# EAGLE design v01 (EAGLE 8.5.2)
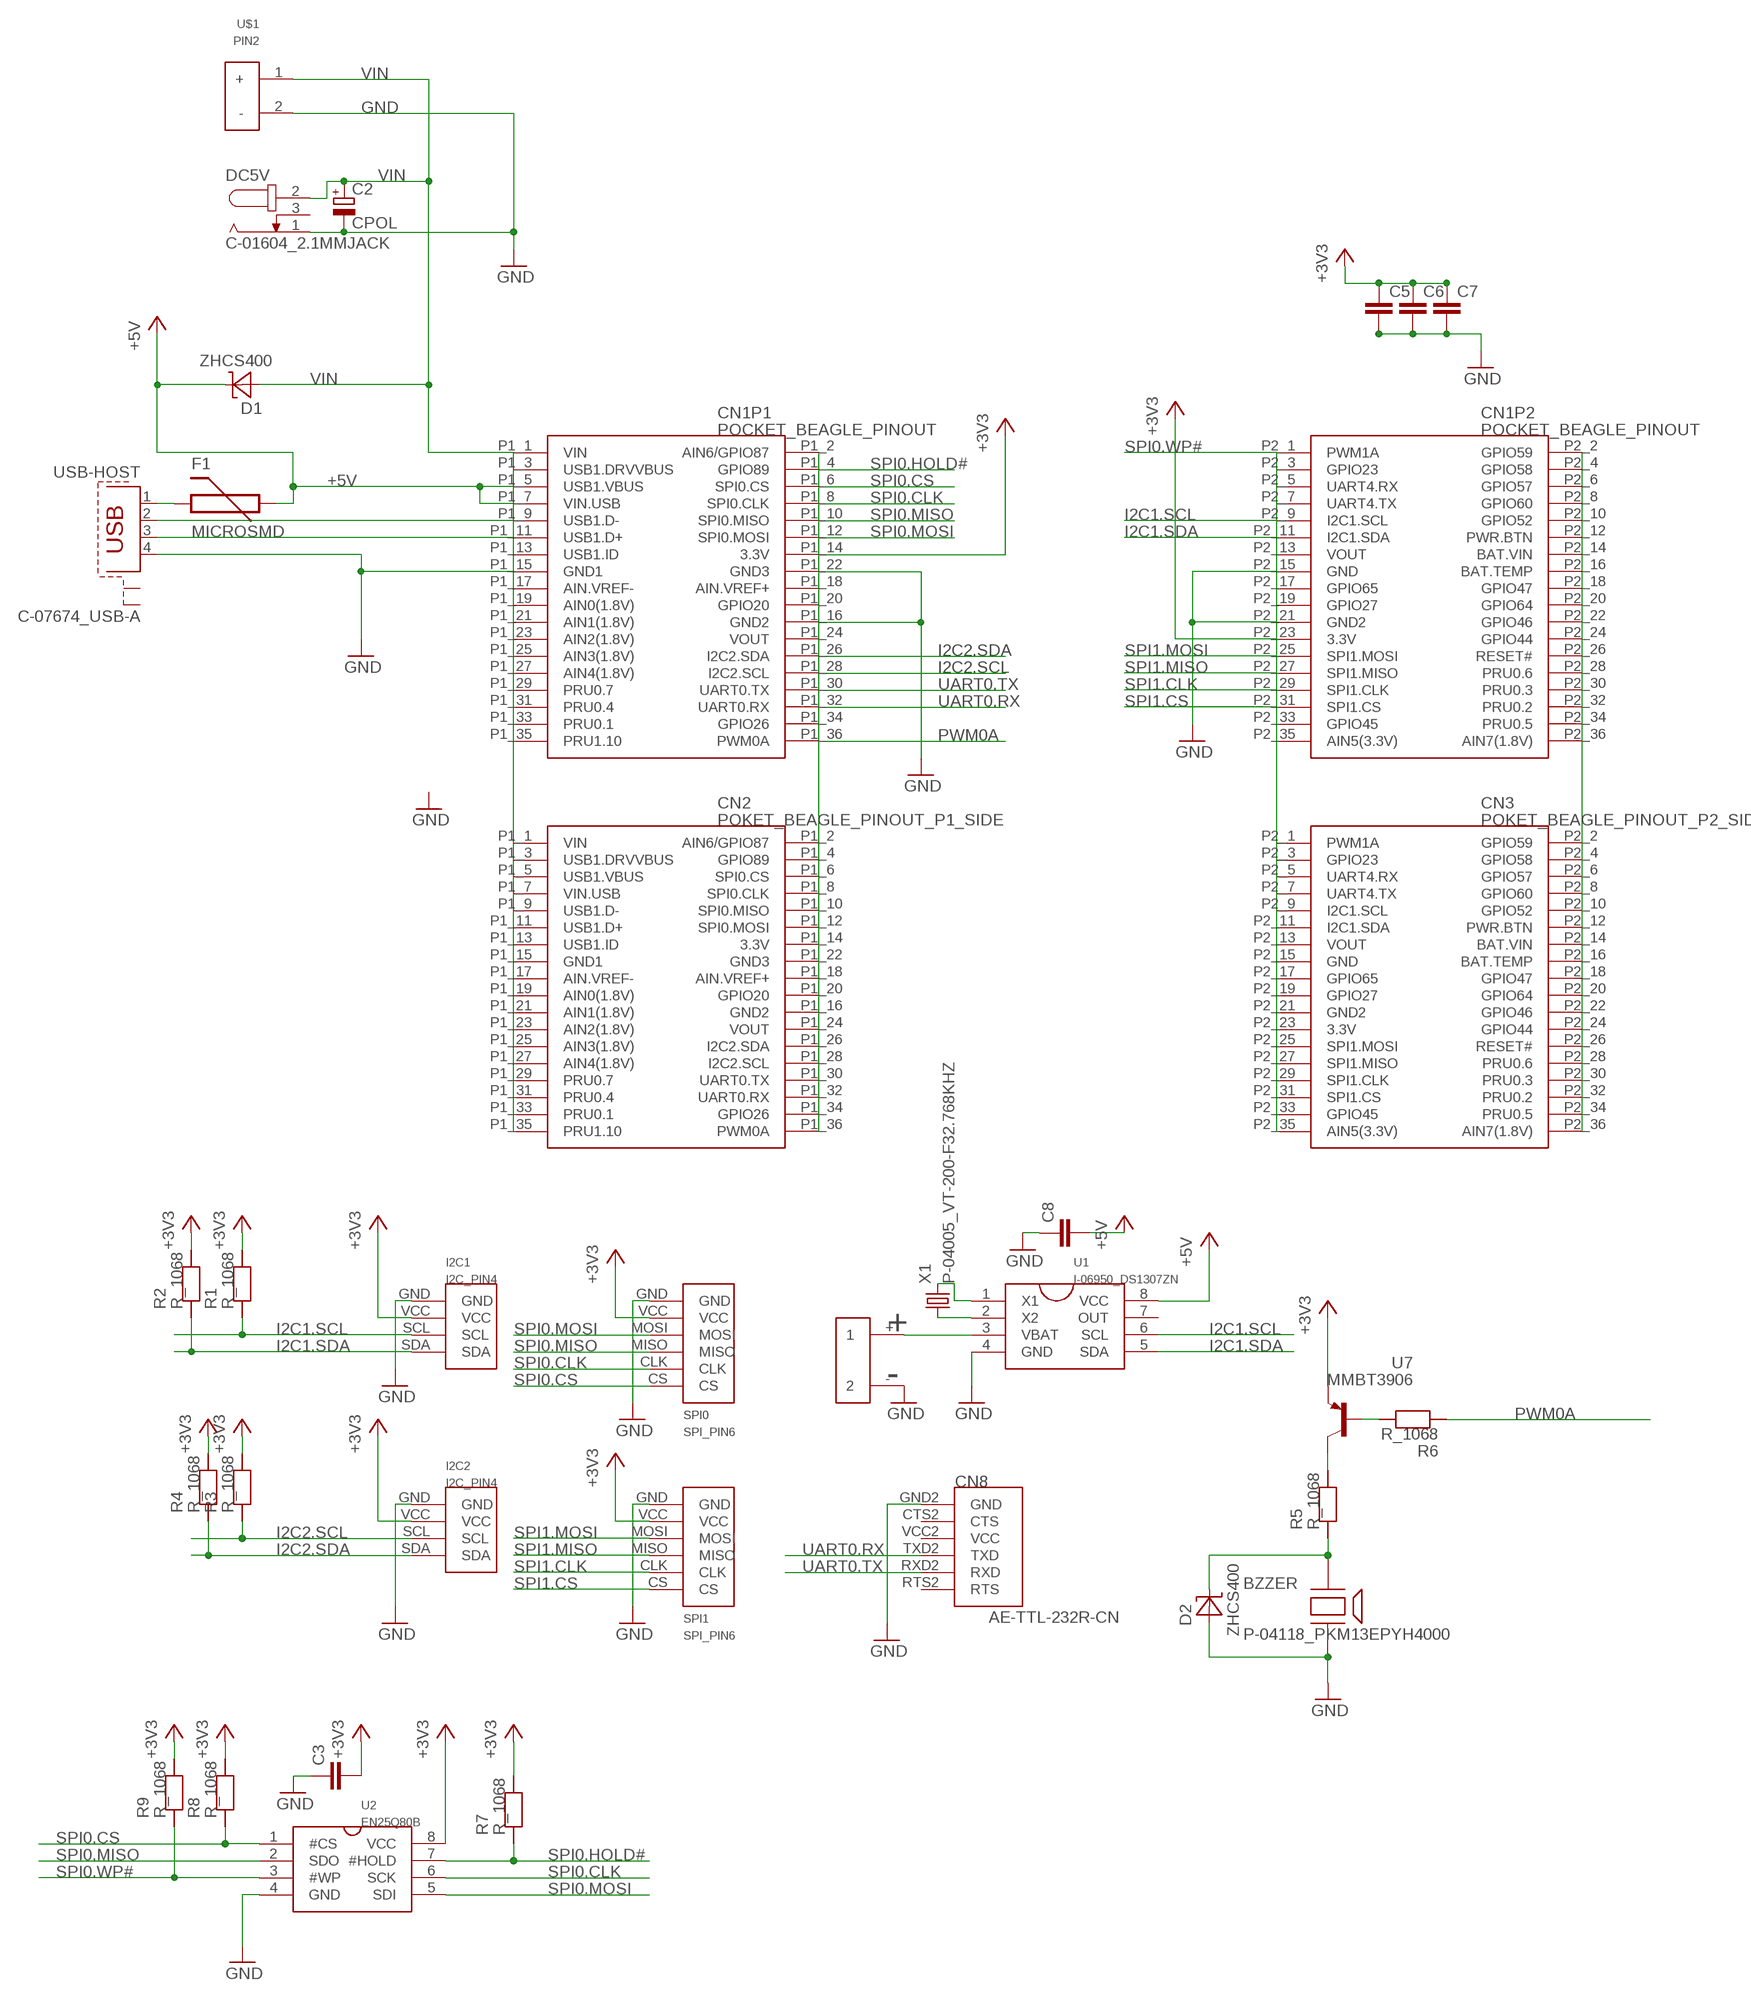
[diagram p0: schematic, sheet 1]

## Parts
BZZER  P-04118_PKM13EPYH4000  [PKM13EPYH4000]
C2  CPOL  [153CLV-0605]
C3  C_1068  [C0603]
C5  C_2012  [C0805K]
C6  C_1068  [C0603]
C7  C_1068  [C0603]
C8  C_1068  [C0603]
CN1  POCKET_BEAGLE_PINOUT  [POCKET_BEAGLE_PINOUT]
CN2  POKET_BEAGLE_PINOUT_P1_SIDE  [POKET_BEAGLE_PINOUT_P1_SIDE]
CN3  POKET_BEAGLE_PINOUT_P2_SIDE  [POKET_BEAGLE_PINOUT_P2_SIDE]
CN8  AE-TTL-232R-CN  [AE-TTL-232R-CN]
CR2032  P-00706_CH25-2032LF  [CH25-2032LF]
D1  ZHCS400  [SOD323-W]
D2  ZHCS400  [SOD323-W]
DC5V  C-01604_2.1MMJACK  [2.1MMJACK]
F1  MICROSMD  [MICROSMD]
I2C1  I2C_PIN4  [I2C_PIN4]
I2C2  I2C_PIN4  [I2C_PIN4]
R1  R_1068  [R0603]
R2  R_1068  [R0603]
R3  R_1068  [R0603]
R4  R_1068  [R0603]
R5  R_1068  [R0603]
R6  R_1068  [R0603]
R7  R_1068  [R0603]
R8  R_1068  [R0603]
R9  R_1068  [R0603]
SPI0  SPI_PIN6  [SPI_PIN6]
SPI1  SPI_PIN6  [SPI_PIN6]
U1  I-06950_DS1307ZN  [SO8]
U2  EN25Q80B  [SO8]
U7  MMBT3906  [SOT23]
U$1  PIN2  [PIN2]
USB-HOST  C-07674_USB-A  [PN87520-S]
X1  P-04005_VT-200-F32.768KHZ  [VT-200F]

## Nets
+3V3: C3.2 C5.1 C6.1 C7.1 CN1.P1_14(P1:3.3V) CN1.P2_23(P2:3.3V) CN2.P1_14(3.3V) CN3.P2_23(3.3V) I2C1.VCC I2C2.VCC R1.2 R2.2 R3.2 R4.2 R7.2 R8.2 R9.2 SPI0.VCC SPI1.VCC U2.8(VCC) U7.2(E)
+5V: C8.2 CN1.P1_5(P1:USB1.VBUS) CN1.P1_7(P1:VIN.USB) CN2.P1_5(USB1.VBUS) CN2.P1_7(VIN.USB) D1.C F1.P$2 U1.8(VCC)
GND: BZZER.2 C2.- C3.1 C5.2 C6.2 C7.2 C8.1 CN1.P1_15(P1:GND1) CN1.P1_16(P1:GND2) CN1.P1_22(P1:GND3) CN1.P2_15(P2:GND) CN1.P2_21(P2:GND2) CN2.P1_15(GND1) CN2.P1_16(GND2) CN2.P1_22(GND3) CN3.P2_15(GND) CN3.P2_21(GND2) CN8.GND2(GND) CR2032.- D2.A DC5V.1(GND) I2C1.GND I2C2.GND SPI0.GND SPI1.GND U1.4(GND) U2.4(GND) U$1.2(-) USB-HOST.4
I2C1.SCL: CN1.P2_9(P2:I2C1.SCL) CN3.P2_9(I2C1.SCL) I2C1.SCL R1.1 U1.6(SCL)
I2C1.SDA: CN1.P2_11(P2:I2C1.SDA) CN3.P2_11(I2C1.SDA) I2C1.SDA R2.1 U1.5(SDA)
I2C2.SCL: CN1.P1_28(P1:I2C2.SCL) CN2.P1_28(I2C2.SCL) I2C2.SCL R3.1
I2C2.SDA: CN1.P1_26(P1:I2C2.SDA) CN2.P1_26(I2C2.SDA) I2C2.SDA R4.1
N$1: CN1.P1_35(P1:PRU1.10) CN2.P1_35(PRU1.10)
N$2: CN1.P1_33(P1:PRU0.1) CN2.P1_33(PRU0.1)
N$3: CN1.P1_31(P1:PRU0.4) CN2.P1_31(PRU0.4)
N$4: CN1.P1_29(P1:PRU0.7) CN2.P1_29(PRU0.7)
N$5: CN1.P1_27(P1:AIN4(1.8V)) CN2.P1_27(AIN4(1.8V))
N$6: CN1.P1_25(P1:AIN3(1.8V)) CN2.P1_25(AIN3(1.8V))
N$7: CN1.P1_23(P1:AIN2(1.8V)) CN2.P1_23(AIN2(1.8V))
N$8: CN1.P1_21(P1:AIN1(1.8V)) CN2.P1_21(AIN1(1.8V))
N$9: CN1.P1_19(P1:AIN0(1.8V)) CN2.P1_19(AIN0(1.8V))
N$10: CN1.P1_17(P1:AIN.VREF-) CN2.P1_17(AIN.VREF-)
N$11: R5.2 U7.3(C)
N$12: BZZER.1 D2.C R5.1
N$13: CN1.P1_11(P1:USB1.D+) CN2.P1_11(USB1.D+) USB-HOST.3
N$14: CN1.P1_9(P1:USB1.D-) CN2.P1_9(USB1.D-) USB-HOST.2
N$15: CN1.P1_13(P1:USB1.ID) CN2.P1_13(USB1.ID)
N$16: R6.2 U7.1(B)
N$17: CN1.P1_3(P1:USB1.DRVVBUS) CN2.P1_3(USB1.DRVVBUS)
N$18: F1.P$1 USB-HOST.1
N$20: CN1.P1_34(P1:GPIO26) CN2.P1_34(GPIO26)
N$25: CN1.P1_24(P1:VOUT) CN2.P1_24(VOUT)
N$27: CN1.P1_20(P1:GPIO20) CN2.P1_20(GPIO20)
N$28: CN1.P1_18(P1:AIN.VREF+) CN2.P1_18(AIN.VREF+)
N$36: CN1.P1_2(P1:AIN6/GPIO87) CN2.P1_2(AIN6/GPIO87)
N$37: CN1.P2_35(P2:AIN5(3.3V)) CN3.P2_35(AIN5(3.3V))
N$38: CN1.P2_33(P2:GPIO45) CN3.P2_33(GPIO45)
N$45: CN1.P2_19(P2:GPIO27) CN3.P2_19(GPIO27)
N$46: CN1.P2_17(P2:GPIO65) CN3.P2_17(GPIO65)
N$48: CN1.P2_13(P2:VOUT) CN3.P2_13(VOUT)
N$51: CN1.P2_7(P2:UART4.TX) CN3.P2_7(UART4.TX)
N$52: CN1.P2_5(P2:UART4.RX) CN3.P2_5(UART4.RX)
N$53: CN1.P2_3(P2:GPIO23) CN3.P2_3(GPIO23)
N$55: CN1.P2_36(P2:AIN7(1.8V)) CN3.P2_36(AIN7(1.8V))
N$56: CN1.P2_34(P2:PRU0.5) CN3.P2_34(PRU0.5)
N$57: CN1.P2_32(P2:PRU0.2) CN3.P2_32(PRU0.2)
N$58: CN1.P2_30(P2:PRU0.3) CN3.P2_30(PRU0.3)
N$59: CN1.P2_28(P2:PRU0.6) CN3.P2_28(PRU0.6)
N$60: CN1.P2_26(P2:RESET#) CN3.P2_26(RESET#)
N$61: CN1.P2_24(P2:GPIO44) CN3.P2_24(GPIO44)
N$62: CN1.P2_22(P2:GPIO46) CN3.P2_22(GPIO46)
N$63: CN1.P2_20(P2:GPIO64) CN3.P2_20(GPIO64)
N$64: CN1.P2_18(P2:GPIO47) CN3.P2_18(GPIO47)
N$65: CN1.P2_16(P2:BAT.TEMP) CN3.P2_16(BAT.TEMP)
N$66: CN1.P2_14(P2:BAT.VIN) CN3.P2_14(BAT.VIN)
N$67: CN1.P2_12(P2:PWR.BTN) CN3.P2_12(PWR.BTN)
N$68: CN1.P2_10(P2:GPIO52) CN3.P2_10(GPIO52)
N$69: CN1.P2_8(P2:GPIO60) CN3.P2_8(GPIO60)
N$70: CN1.P2_6(P2:GPIO57) CN3.P2_6(GPIO57)
N$71: CN1.P2_4(P2:GPIO58) CN3.P2_4(GPIO58)
N$72: CN1.P2_2(P2:GPIO59) CN3.P2_2(GPIO59)
N$73: U1.2(X2) X1.1
N$74: U1.1(X1) X1.2
N$75: CR2032.+ U1.3(VBAT)
PWM0A: CN1.P1_36(P1:PWM0A) CN2.P1_36(PWM0A) R6.1
SPI0.CLK: CN1.P1_8(P1:SPI0.CLK) CN2.P1_8(SPI0.CLK) SPI0.CLK U2.6(SCK)
SPI0.CS: CN1.P1_6(P1:SPI0.CS) CN2.P1_6(SPI0.CS) R8.1 SPI0.CS U2.1(#CS)
SPI0.HOLD#: CN1.P1_4(P1:GPIO89) CN2.P1_4(GPIO89) R7.1 U2.7(#HOLD)
SPI0.MISO: CN1.P1_10(P1:SPI0.MISO) CN2.P1_10(SPI0.MISO) SPI0.MISO U2.2(SDO)
SPI0.MOSI: CN1.P1_12(P1:SPI0.MOSI) CN2.P1_12(SPI0.MOSI) SPI0.MOSI U2.5(SDI)
SPI0.WP#: CN1.P2_1(P2:PWM1A) CN3.P2_1(PWM1A) R9.1 U2.3(#WP)
SPI1.CLK: CN1.P2_29(P2:SPI1.CLK) CN3.P2_29(SPI1.CLK) SPI1.CLK
SPI1.CS: CN1.P2_31(P2:SPI1.CS) CN3.P2_31(SPI1.CS) SPI1.CS
SPI1.MISO: CN1.P2_27(P2:SPI1.MISO) CN3.P2_27(SPI1.MISO) SPI1.MISO
SPI1.MOSI: CN1.P2_25(P2:SPI1.MOSI) CN3.P2_25(SPI1.MOSI) SPI1.MOSI
UART0.RX: CN1.P1_32(P1:UART0.RX) CN2.P1_32(UART0.RX) CN8.TXD2(TXD)
UART0.TX: CN1.P1_30(P1:UART0.TX) CN2.P1_30(UART0.TX) CN8.RXD2(RXD)
VIN: C2.+ CN1.P1_1(P1:VIN) CN2.P1_1(VIN) D1.A DC5V.2(VCC) U$1.1(+)
Unconnected: CN8.CTS2(CTS) CN8.RTS2(RTS) CN8.VCC2(VCC) DC5V.3(S) U1.7(OUT) USB-HOST.S1 USB-HOST.S2

## Library data of the parts
BZZER = Pocket_Beagle_Pinout:P-04118_PKM13EPYH4000
C2 = Pocket_Beagle_Pinout:CPOL
C3 C6-C8 = Pocket_Beagle_Pinout:C_1068
C5 = Pocket_Beagle_Pinout:C_2012
CN1 = Pocket_Beagle_Pinout:POCKET_BEAGLE_PINOUT
CN2 = Pocket_Beagle_Pinout:POKET_BEAGLE_PINOUT_P1_SIDE
CN3 = Pocket_Beagle_Pinout:POKET_BEAGLE_PINOUT_P2_SIDE
CN8 = Pocket_Beagle_Pinout:AE-TTL-232R-CN
CR2032 = Pocket_Beagle_Pinout:P-00706_CH25-2032LF
D1 D2 = Pocket_Beagle_Pinout:ZHCS400
DC5V = Pocket_Beagle_Pinout:C-01604_2.1MMJACK
F1 = Pocket_Beagle_Pinout:MICROSMD
I2C1 I2C2 = Pocket_Beagle_Pinout:I2C_PIN4
R1-R9 = Pocket_Beagle_Pinout:R_1068
SPI0 SPI1 = Pocket_Beagle_Pinout:SPI_PIN6
U1 = Pocket_Beagle_Pinout:I-06950_DS1307ZN
U2 = Pocket_Beagle_Pinout:EN25Q80B
U7 = AE-MachXO2:MMBT3906
U$1 = Pocket_Beagle_Pinout:PIN2
USB-HOST = Pocket_Beagle_Pinout:C-07674_USB-A; OC_FARNELL: unknown; OC_NEWARK: unknown
X1 = Pocket_Beagle_Pinout:P-04005_VT-200-F32.768KHZ

## Board
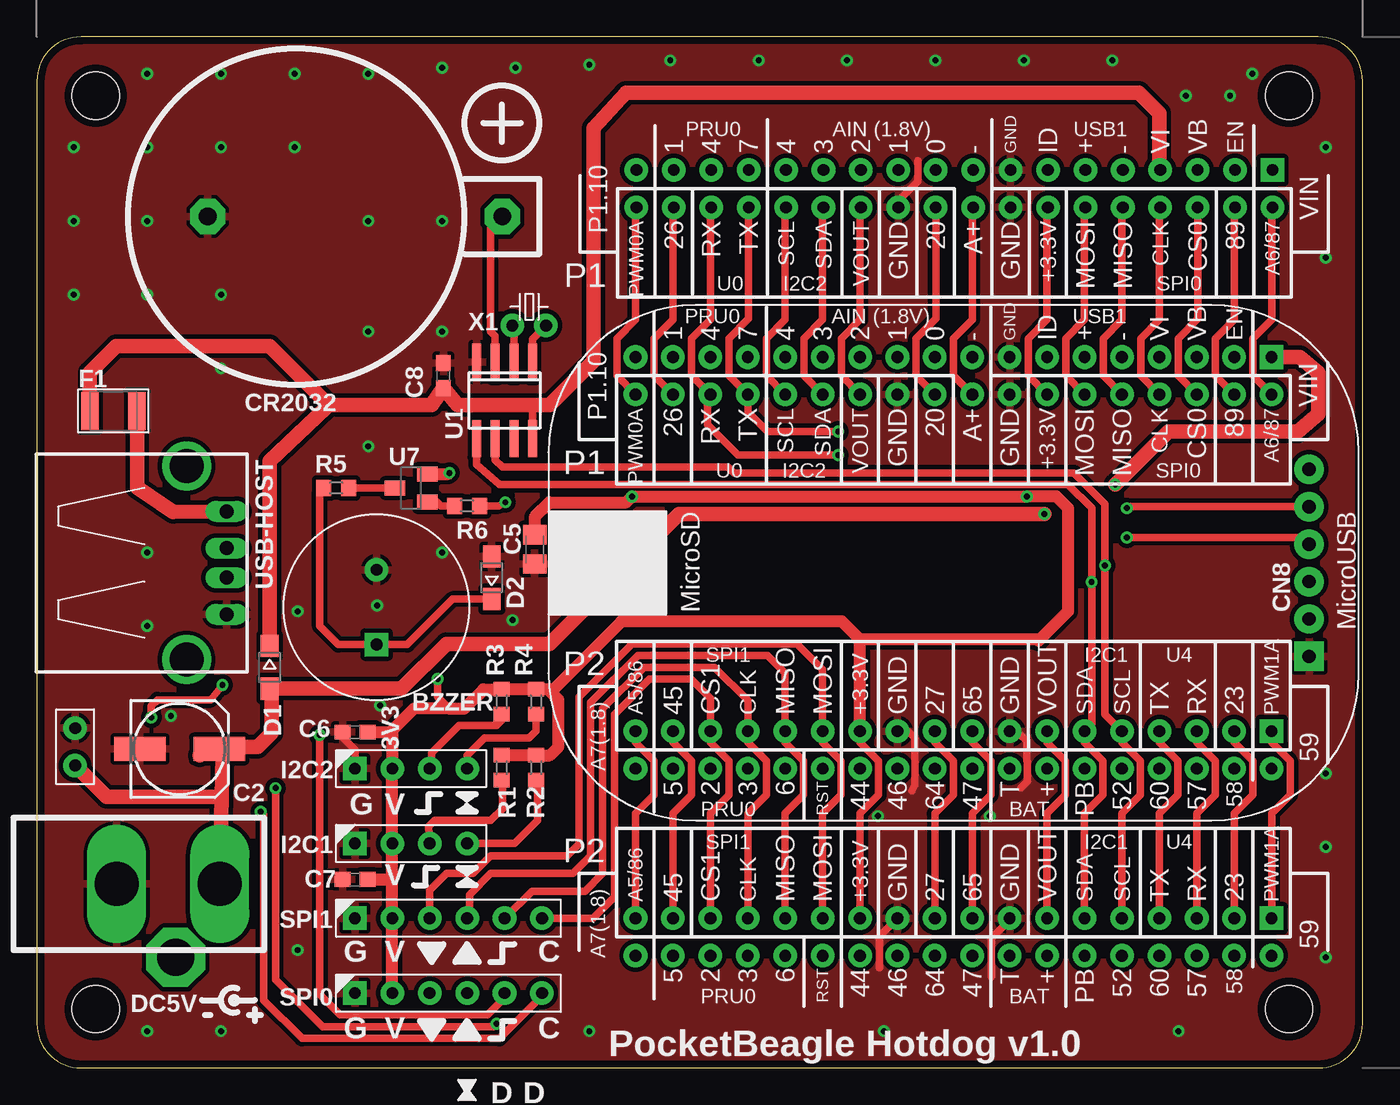
[diagram p1: board, top side]
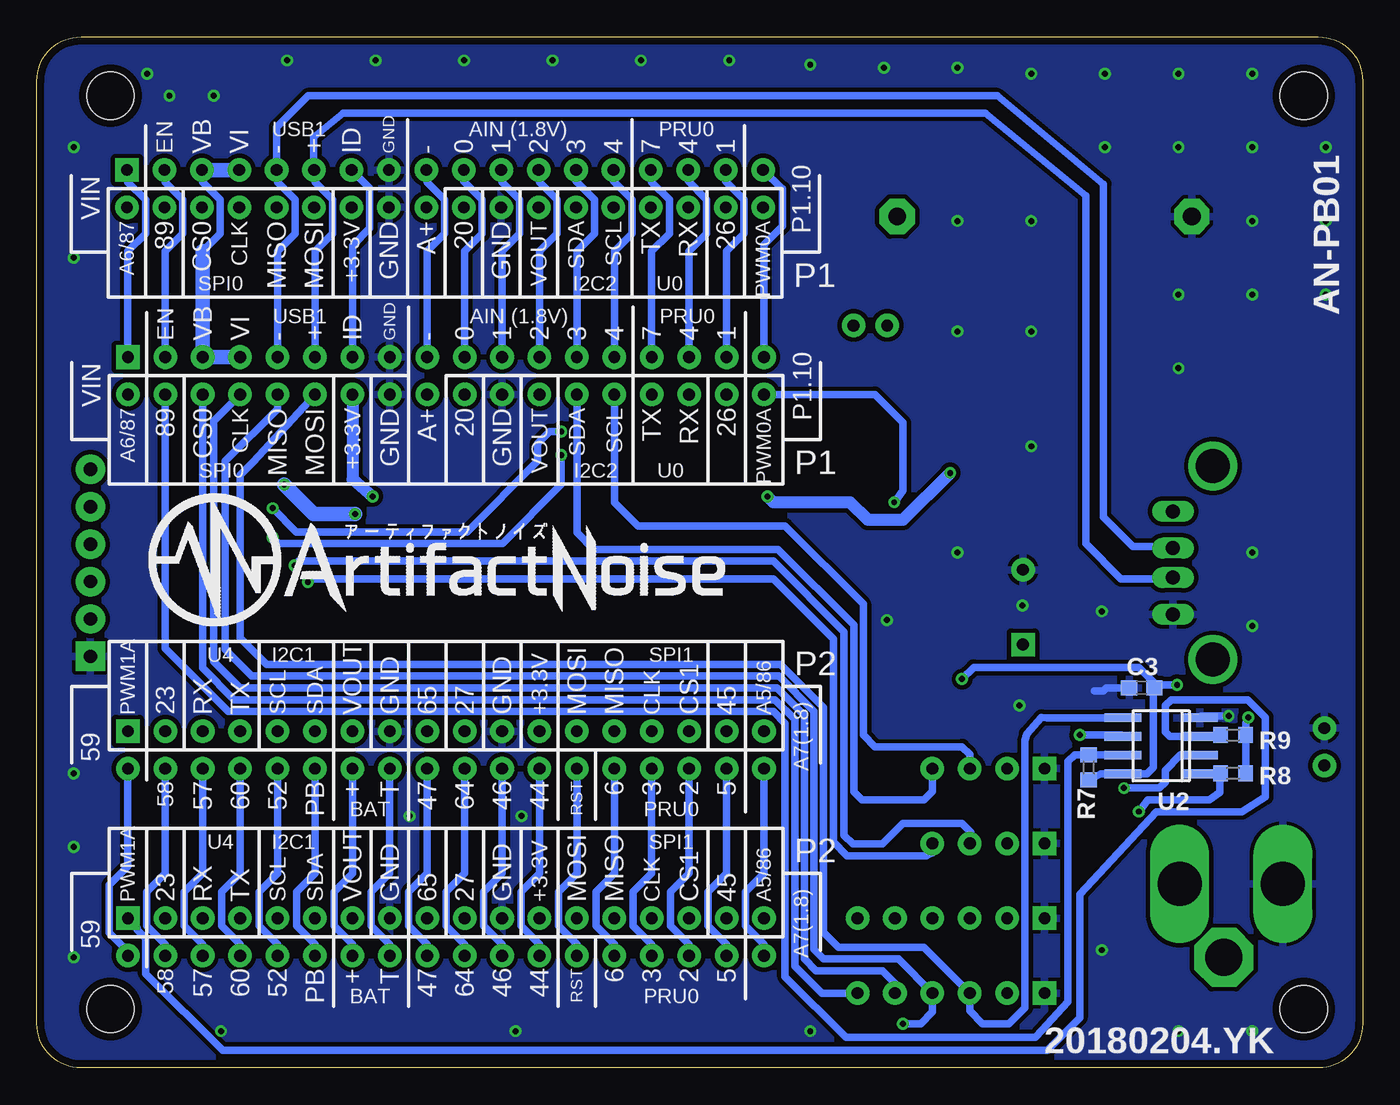
[diagram p2: board, bottom side, seen from below]

Size 90 x 70 mm. Coordinates in mm from the lower left corner, seen from the top.
Outline: 0,67 0,3 arc90 3,0 87,0 arc90 90,3 90,67 arc90 87,70 3,70 arc90 0,67
Copper layers (1*16): Top 0.035mm / dielectric 1.6mm / Bottom 0.035mm
Design rules "Elecrow_2-layer_PCB_eagle_rule": minimum track width 6mil, minimum drill 12mil, track to track 6mil, track to pad 6mil, pad to pad 6mil, via to via 8mil, smd to smd 0mil, copper to edge 20mil, drill to drill 10mil, minimum pad ring 6mil, minimum via ring 6mil, stop-mask expansion 0mil, vias tented up to drill 100mil, thermal gap 10mil
Holes 3.2 mm at 4,4 85,4 85,66 4,66

### Footprints (pad centres in the part's own frame; a part is rotated, then mirrored left to right if it is on the bottom)
PKM13EPYH4000 = drill 0.8 pad 1.6 square: 1 0,0 | drill 0.8 pad 1.6: 2 5.08,0
153CLV-0605 = smd 3.5 x 1.6: + 2.7,0; - -2.7,0
C0603 = smd 1.1 x 1: 1 -0.85,0; 2 0.85,0
C0805K = smd 1.3 x 1.6: 1 -1,0; 2 1,0
POCKET_BEAGLE_PINOUT = drill 0.8 pad 1.6 square: P1_1 -21.59,-13.97; P2_1 -21.59,11.43 | drill 0.8 pad 1.6: P1_2 -21.59,-11.43; P1_3 -19.05,-13.97; P1_4 -19.05,-11.43; P1_5 -16.51,-13.97; P1_6 -16.51,-11.43; P1_7 -13.97,-13.97; P1_8 -13.97,-11.43; P1_9 -11.43,-13.97; P1_10 -11.43,-11.43; P1_11 -8.89,-13.97; P1_12 -8.89,-11.43; P1_13 -6.35,-13.97; P1_14 -6.35,-11.43; P1_15 -3.81,-13.97; P1_16 -3.81,-11.43; P1_17 -1.27,-13.97; P1_18 -1.27,-11.43; P1_19 1.27,-13.97; P1_20 1.27,-11.43; P1_21 3.81,-13.97; P1_22 3.81,-11.43; P1_23 6.35,-13.97; P1_24 6.35,-11.43; P1_25 8.89,-13.97; P1_26 8.89,-11.43; P1_27 11.43,-13.97; P1_28 11.43,-11.43; P1_29 13.97,-13.97; P1_30 13.97,-11.43; P1_31 16.51,-13.97; P1_32 16.51,-11.43; P1_33 19.05,-13.97; P1_34 19.05,-11.43; P1_35 21.59,-13.97; P1_36 21.59,-11.43; P2_2 -21.59,13.97; P2_3 -19.05,11.43; P2_4 -19.05,13.97; P2_5 -16.51,11.43; P2_6 -16.51,13.97; P2_7 -13.97,11.43; P2_8 -13.97,13.97; P2_9 -11.43,11.43; P2_10 -11.43,13.97; P2_11 -8.89,11.43; P2_12 -8.89,13.97; P2_13 -6.35,11.43; P2_14 -6.35,13.97; P2_15 -3.81,11.43; P2_16 -3.81,13.97; P2_17 -1.27,11.43; P2_18 -1.27,13.97; P2_19 1.27,11.43; P2_20 1.27,13.97; P2_21 3.81,11.43; P2_22 3.81,13.97; P2_23 6.35,11.43; P2_24 6.35,13.97; P2_25 8.89,11.43; P2_26 8.89,13.97; P2_27 11.43,11.43; P2_28 11.43,13.97; P2_29 13.97,11.43; P2_30 13.97,13.97; P2_31 16.51,11.43; P2_32 16.51,13.97; P2_33 19.05,11.43; P2_34 19.05,13.97; P2_35 21.59,11.43; P2_36 21.59,13.97
POKET_BEAGLE_PINOUT_P1_SIDE = drill 0.8 pad 1.6 square: P1_1 -21.649,-1.27 | drill 0.8 pad 1.6: P1_2 -21.649,1.27; P1_3 -19.109,-1.27; P1_4 -19.109,1.27; P1_5 -16.569,-1.27; P1_6 -16.569,1.27; P1_7 -14.029,-1.27; P1_8 -14.029,1.27; P1_9 -11.489,-1.27; P1_10 -11.489,1.27; P1_11 -8.949,-1.27; P1_12 -8.949,1.27; P1_13 -6.409,-1.27; P1_14 -6.409,1.27; P1_15 -3.869,-1.27; P1_16 -3.869,1.27; P1_17 -1.329,-1.27; P1_18 -1.329,1.27; P1_19 1.211,-1.27; P1_20 1.211,1.27; P1_21 3.751,-1.27; P1_22 3.751,1.27; P1_23 6.291,-1.27; P1_24 6.291,1.27; P1_25 8.831,-1.27; P1_26 8.831,1.27; P1_27 11.371,-1.27; P1_28 11.371,1.27; P1_29 13.911,-1.27; P1_30 13.911,1.27; P1_31 16.451,-1.27; P1_32 16.451,1.27; P1_33 18.991,-1.27; P1_34 18.991,1.27; P1_35 21.531,-1.27; P1_36 21.531,1.27
POKET_BEAGLE_PINOUT_P2_SIDE = drill 0.8 pad 1.6 square: P2_1 -21.59,-1.27 | drill 0.8 pad 1.6: P2_2 -21.59,1.27; P2_3 -19.05,-1.27; P2_4 -19.05,1.27; P2_5 -16.51,-1.27; P2_6 -16.51,1.27; P2_7 -13.97,-1.27; P2_8 -13.97,1.27; P2_9 -11.43,-1.27; P2_10 -11.43,1.27; P2_11 -8.89,-1.27; P2_12 -8.89,1.27; P2_13 -6.35,-1.27; P2_14 -6.35,1.27; P2_15 -3.81,-1.27; P2_16 -3.81,1.27; P2_17 -1.27,-1.27; P2_18 -1.27,1.27; P2_19 1.27,-1.27; P2_20 1.27,1.27; P2_21 3.81,-1.27; P2_22 3.81,1.27; P2_23 6.35,-1.27; P2_24 6.35,1.27; P2_25 8.89,-1.27; P2_26 8.89,1.27; P2_27 11.43,-1.27; P2_28 11.43,1.27; P2_29 13.97,-1.27; P2_30 13.97,1.27; P2_31 16.51,-1.27; P2_32 16.51,1.27; P2_33 19.05,-1.27; P2_34 19.05,1.27; P2_35 21.59,-1.27; P2_36 21.59,1.27
AE-TTL-232R-CN = drill 0.9 pad 2: CTS2 -1.27,3.81; RTS2 -1.27,-6.35; RXD2 -1.27,-3.81; TXD2 -1.27,-1.27; VCC2 -1.27,1.27 | drill 0.9 pad 2 square: GND2 -1.27,6.35
CH25-2032LF = drill 1.2 pad 2.4 octagon: + 0,-14; - 0,6
SOD323-W = smd 1.5 x 1.2: A 1.45,0; C -1.45,0
2.1MMJACK = drill 3 pad 3.3 long: 1 0,0; 2 0,7 | drill 2.5 pad 4 octagon: 3 5,4
MICROSMD = smd 1.2 x 2.6: P$1 -1.6,0; P$2 1.6,0
I2C_PIN4 = drill 0.8 pad 1.6 square: GND 0,3.81 | drill 0.8 pad 1.6: SCL 0,-1.27; SDA 0,-3.81; VCC 0,1.27
R0603 = smd 1 x 1.1: 1 -0.85,0; 2 0.85,0
SPI_PIN6 = drill 0.8 pad 1.6: CLK 0,-6.35; CS 0,-8.89; MISO 0,-3.81; MOSI 0,-1.27; VCC 0,1.27 | drill 0.8 pad 1.6 square: GND 0,3.81
SO8 = smd 0.6 x 2.5: 1 -0.635,-1.33; 2 0.635,-1.33; 3 1.905,-1.33; 4 3.175,-1.33; 5 3.175,3.87; 6 1.905,3.87; 7 0.635,3.87; 8 -0.635,3.87
SOT23 = smd 1 x 1.4: 1 -0.95,-1.1; 2 0.95,-1.1; 3 0,1.1
PIN2 = drill 0.8 pad 1.6: 1 0,1.27; 2 0,-1.27
PN87520-S = drill 0.95 long: 1 -3.5,2.71; 2 -1,2.71; 3 1,2.71; 4 3.5,2.71 | drill 2.3 pad 2.9: S1 -6.57,0; S2 6.57,0
VT-200F = drill 0.8 pad 1.6: 1 -1.143,0; 2 1.143,0

### Placement (x,y rotation side)
BZZER  23.06,28.74 90 top
C2  9.69,21.66 0 top
C3  15,25.8 0 bottom
C5  33.8,35.2 270 top
C6  21.6,22.8 180 top
C7  21.6,12.8 180 top
C8  27.6,47 270 top
CN1  62.23,34.29 180 top
CN2  62.23,59.69 180 top
CN3  62.23,8.89 180 top
CN8  85.09,34.29 180 top
CR2032  17.6,57.8 90 top
D1  15.8,27.2 270 top
D2  30.88,33.28 90 top
DC5V  5.42,12.5 270 top
DRILEGEND  [DRILEGEND]  131.27,0.26 0 top  (outside the outline)
F1  5.2,44.6 180 top
I2C1  25.4,15.24 90 top
I2C2  25.4,20.32 90 top
R1  31.55,20.38 90 top
R2  33.89,20.38 90 top
R3  31.55,24.86 90 top
R4  33.89,24.86 90 top
R5  20.32,39.37 0 top
R6  29.21,38.15 180 top
R7  18.6,20.4 270 bottom
R8  8.8,20 0 bottom
R9  8.8,22.6 0 bottom
SPI0  25.4,5.08 90 top
SPI1  25.4,10.16 90 top
U1  33.02,46.59 180 top
U2  12.4,20.6 90 bottom
U7  25.4,39.37 90 top
U$1  2.6,21.8 180 top
U$3  [AN-POGO2_LITTLE_BIG]  82.4,30 0 bottom
USB-HOST  10.16,34.29 270 top
X1  33.42,50.4 0 top

### Tracks (layer width: path | path; a pad name or v marks a point on that pad's centre or on a via)
+3V3  (via drill 0.4 pad 0.8)
  Top 0.5: CN1.P1_14 67.31,46.99 67.31,49.53 68.58,50.8 68.58,58.36 CN2.P1_14 | CN1.P2_23 55.88,22.09 57.13,20.84 57.13,18.53 55.88,17.28 CN3.P2_23 | v27.2,26.4 27.2,25.2 28,24.4 | v7.77,23.8 7.77,24.57 8.2,25 11.8,25 v12.6,26
  Top 0.8: SPI0.VCC SPI1.VCC 24.13,12.8 | 24.13,12.8 I2C1.VCC I2C2.VCC 24.13,22.93 | R1.2 R2.2 34.83,21.23 35.4,21.8 35.4,25 34.69,25.71 | 24.13,22.93 25.6,24.4 28,24.4 29,24.4 30.31,25.71 R3.2 R4.2 34.69,25.71 | 26.4,40.42 U7.2 27.92,40.32 v28,40.4 | C7.1 24.13,12.8 | 24.13,22.93 24,22.8 C6.1 | C5.1 33.8,37.4 34.8,38.4 40,38.4 v40.4,38.8 v67.2,38.8 69.2,38.8 70,38 70,31 68,29 67.92,29.08 55.88,29.08 | CN1.P2_23 55.88,29.08 | 55.88,29.08 54.65,30.31 39.69,30.31 35.09,25.71 34.69,25.71
  Bottom 0.5: R7.2 17.79,19.96 U2.8 14.63,19.96 14.2,20.4 14.2,25.75 C3.2 | R8.2 R9.2 7.95,23.42 v7.77,23.8 | C3.2 14.15,25.95 13.6,26 v12.6,26 | v27.2,26.4 26.4,27.2 15.2,27.2 14.15,26.15 C3.2
  Bottom 0.8: CN1.P1_14 68.58,39.98 v67.2,38.8 | v28,40.4 31.2,37.2 33.6,37.2 34.8,38.4 40,38.4 v40.4,38.8
+5V
  Top 0.5: U1.8 33.66,44.95 33.6,45
  Top 1: CN2.P1_7 76.2,61.02 76.2,64.8 74.8,66.2 40,66.2 37.8,63.8 37.8,48 34.8,45 33.6,45 28.55,45 C8.2 27.6,46.2 26.8,45 19.8,45 | 19.8,45 19.6,44.8 15.8,41.2 D1.C 15.75,28.6 | F1.P$2 3.6,47.2 5.4,49 15.8,49 19.8,45
  Bottom 0.5: CN2.P1_5 78.74,60.96 78.74,60.13 77.55,58.94 77.55,56.63 78.74,55.44
  Bottom 1: 78.74,55.44 CN1.P1_5 CN1.P1_7 | CN2.P1_5 CN2.P1_7
GND  (via drill 0.4 pad 0.8)
  Top 0.5: 59.4,18.8 59.6,19.2 59.6,19.8 59.62,19.82 59.62,22.38 59.4,22.6 59.16,22.8 CN1.P2_21 | CN1.P2_15 66.78,22.6 67.2,22.2 67.2,20.86 67.24,20.82 67.24,19.44 66.8,19 | C6.2 20.75,22.45 21.6,21.6 I2C2.GND | CN3.P2_21 57.2,8.94 57.2,6.8 | CN3.P2_15 66.04,10.04 64.8,8.8 64.8,6.2 | CN2.P1_22 58.48,58.88 59.8,60.2 59.8,61.6
  Bottom 0.5: U2.4 10.95,23.9 v9.1,23.9 | C3.1 17.4,25.8 17.6,25.6 18.2,25.6
  other vias: 7.5,2.5 12.5,2.5 37.5,2.5 57.5,2.5 77.5,2.5 87.5,7.5 87.5,15 87.5,20 87.5,62.5 82.5,67.5 2.5,52.5 2.5,57.5 2.5,62.5 7.5,67.5 12.5,67.5 17.5,67.5 22.5,67.5 27.5,67.9 32.5,67.9 37.5,68.1 7.5,62.5 7.5,57.5 7.5,52.5 12.5,62.5 17.5,62.5 12.5,52.5 12.5,47.5 22.5,57.5 22.5,50 27.5,57.5 27.5,50 27.5,35 7.5,35 7.5,30 43,68.4 49,68.4 55,68.4 61,68.4 67,68.4 73,68.4 78,66 81,66 87.5,55 32.3,30.4 23.1,31.4 23.3,24.6 57.1,17.1 64.7,17.1 17.7,8 17.7,31 22.5,42.2
  pour Top (isolate 0.3): -0.4,70.2 90.6,70.2 90.8,-0.2 -0.2,-0.2
  pour Bottom (isolate 0.3): -0.4,70.2 90.6,70.2 90.8,-0.2 -0.2,-0.2
I2C1.SCL  (via drill 0.4 pad 0.8)
  Top 0.5: CN3.P2_9 73.66,17.28 74.91,18.53 74.91,20.84 73.66,22.09 CN1.P2_9 72.51,24.01 v72.51,34.11 72.51,38.29 70.4,40.4 47.32,40.4 46.92,40.8 31.6,40.8 31.11,41.28 U1.6 | I2C1.SCL 26.6,16.4 27,16.8 30.8,16.8 31.6,17.6 31.6,19.48 R1.1
  Bottom 0.5: v72.51,34.11 72.22,34.4 40,34.4 35.2,29.6 35.2,15.8 34.6,15.2 32.6,15.2 31.2,16.6 27.2,16.6 26.6,16 26.67,15.93 I2C1.SCL
I2C1.SDA  (via drill 0.4 pad 0.8)
  Top 0.5: CN3.P2_11 71.12,17.28 72.37,18.53 72.37,20.84 71.12,22.09 CN1.P2_11 71.6,23.34 v71.6,33 71.6,38 70,39.6 31.4,39.6 29.84,40.95 U1.5 | 29.57,15.6 I2C1.SDA 32.44,15.24 34,16.8 34,19.42 R2.1
  Bottom 0.5: v71.6,33 71.2,33.2 40,33.2 35.94,29.14 35.94,15.34 35,14.4 29.6,14.4 29.2,14.6 29.21,14.79 I2C1.SDA
I2C2.SCL
  Top 0.5: CN1.P1_28 49.53,46.99 49.53,49.53 50.8,50.8 50.8,58.42 CN2.P1_28 | I2C2.SCL 26.8,20.45 26.8,21.4 28.65,23.25 31.2,23.25 31.55,23.6 R3.1
  Bottom 0.5: CN1.P1_28 50.8,38.4 49.2,36.8 39.2,36.8 33.9,31.5 33.9,22.6 33.09,21.8 27.2,21.8 26.67,21.27 I2C2.SCL
I2C2.SDA
  Top 0.5: CN1.P1_26 52.07,46.99 52.07,49.53 53.34,50.8 53.34,58.36 CN2.P1_26 | I2C2.SDA 29.21,21.21 30.4,22.4 33.4,22.4 33.89,22.89 R4.1
  Bottom 0.5: I2C2.SDA 29.21,18.79 29.8,18.2 34,18.2 34.55,18.75 34.55,30.07 39.68,35.2 52.2,35.2 53.34,36.34 CN1.P1_26
N$1
  Bottom 0.5: CN1.P1_35 40.64,55.88 39.37,57.15 39.37,59.69 39.43,59.69 CN2.P1_35
N$2
  Bottom 0.5: CN2.P1_33 43.24,60.19 41.99,58.94 41.99,56.63 43.18,55.44 CN1.P1_33
N$3
  Bottom 0.5: CN2.P1_31 45.78,60.19 44.53,58.94 44.53,56.63 45.72,55.44 CN1.P1_31
N$4
  Bottom 0.5: CN2.P1_29 48.26,60.96 48.26,60.13 47.07,58.94 47.07,56.63 48.26,55.44 CN1.P1_29
N$5
  Bottom 0.5: CN2.P1_27 50.86,60.19 49.61,58.94 49.61,56.63 50.8,55.44 CN1.P1_27
N$6
  Bottom 0.5: CN2.P1_25 53.4,60.19 52.15,58.94 52.15,56.63 53.34,55.44 CN1.P1_25
N$7
  Bottom 0.5: CN2.P1_23 55.88,60.96 55.88,60.13 54.69,58.94 54.69,56.63 55.88,55.44 CN1.P1_23
N$8
  Bottom 0.5: CN2.P1_21 58.42,60.96 58.42,60.13 57.23,58.94 57.23,56.63 58.42,55.44 CN1.P1_21
N$9
  Bottom 0.5: CN2.P1_19 61.02,60.19 59.77,58.94 59.77,56.63 60.96,55.44 CN1.P1_19
N$10
  Bottom 0.5: CN2.P1_17 63.5,60.96 63.5,60.13 62.31,58.94 62.31,56.63 63.5,55.44 CN1.P1_17
N$11
  Top 0.5: R5.2 U7.3
N$12
  Top 0.5: R5.1 19.2,39.1 19.2,30 20.46,28.74 BZZER.1 25.14,28.74 28.23,31.83 D2.C
N$13
  Bottom 0.5: CN2.P1_11 71.12,60.96 | 71.12,60.96 71.12,60.13 69.93,58.94 69.93,56.63 71.12,55.44 CN1.P1_11 | 71.12,60.96 71.2,61.04 71.2,63.2 69.2,64.8 25.6,64.8 18.8,59.2 18.8,36.8 18.8,36.6 18.8,35.6 16.4,33.2 12.91,33.2 USB-HOST.3
N$14
  Bottom 0.5: CN1.P1_9 73.66,55.44 72.47,56.63 72.47,58.94 73.66,60.13 73.66,60.96 CN2.P1_9 73.72,63.88 71.6,66 24.8,66 17.6,60 17.6,37.4 15.6,35.4 12.91,35.4 USB-HOST.2
N$15
  Bottom 0.5: CN1.P1_13 68.58,55.82 67.4,57 67.4,59.72 CN2.P1_13
N$16
  Top 0.5: R6.2 27.45,38.15 27.18,38.42 U7.1
N$17
  Bottom 0.5: CN2.P1_3 81.28,60.96 81.28,60.13 80.09,58.94 80.09,56.63 81.28,55.44 CN1.P1_3
N$18
  Top 1: F1.P$1 6.8,39.4 9.26,37.74 USB-HOST.1
N$20
  Top 0.5: CN1.P1_34 41.91,46.99 41.91,49.53 43.18,50.8 43.18,58.36 CN2.P1_34
N$25
  Top 0.5: CN1.P1_24 54.61,46.99 54.61,49.53 55.88,50.8 55.88,58.36 CN2.P1_24
N$27
  Top 0.5: CN1.P1_20 59.69,46.99 59.69,49.53 61.02,50.86 CN2.P1_20
N$28
  Top 0.5: CN1.P1_18 62.23,46.99 62.23,49.53 63.5,50.8 63.5,58.36 CN2.P1_18
N$36
  Top 0.5: CN1.P1_2 82.55,46.99 82.55,49.53 83.82,50.8 83.82,58.36 CN2.P1_2
N$37
  Top 0.5: CN1.P2_35 40.64,22.09 41.89,20.84 41.89,18.53 40.64,17.28 CN3.P2_35
N$38
  Top 0.5: CN1.P2_33 43.18,22.09 44.43,20.84 44.43,18.53 43.18,17.28 CN3.P2_33
N$45
  Top 0.5: CN1.P2_19 60.96,22.09 62.21,20.84 62.21,18.53 60.96,17.28 CN3.P2_19
N$46
  Top 0.5: CN1.P2_17 63.5,22.09 64.75,20.84 64.75,18.53 63.5,17.28 CN3.P2_17
N$48
  Top 0.5: CN1.P2_13 68.58,22.09 69.83,20.84 69.83,18.53 68.58,17.28 CN3.P2_13
N$51
  Top 0.5: CN1.P2_7 76.2,22.09 77.45,20.84 77.45,18.53 76.2,17.28 CN3.P2_7
N$52
  Top 0.5: CN1.P2_5 78.74,22.09 79.99,20.84 79.99,18.53 78.74,17.28 CN3.P2_5
N$53
  Top 0.5: CN1.P2_3 81.28,22.09 82.53,20.84 82.53,18.53 81.28,17.28 CN3.P2_3
N$55
  Bottom 0.5: CN1.P2_36 40.64,13.2 41.89,11.95 41.89,9.64 40.64,8.39 CN3.P2_36
N$56
  Bottom 0.5: CN1.P2_34 43.18,13.2 44.43,11.95 44.43,9.64 43.18,8.39 CN3.P2_34
N$57
  Bottom 0.5: CN1.P2_32 45.72,13.2 46.97,11.95 46.97,9.64 45.72,8.39 CN3.P2_32
N$58
  Bottom 0.5: CN1.P2_30 48.26,13.2 49.51,11.95 49.51,9.64 48.26,8.39 CN3.P2_30
N$59
  Bottom 0.5: CN1.P2_28 50.8,13.2 52.05,11.95 52.05,9.64 50.8,8.39 CN3.P2_28
N$60
  Bottom 0.5: CN1.P2_26 53.34,13.2 54.59,11.95 54.59,9.64 53.34,8.39 CN3.P2_26
N$61
  Bottom 0.5: CN1.P2_24 55.88,13.2 57.13,11.95 57.13,9.64 55.88,8.39 CN3.P2_24
N$62
  Bottom 0.5: CN1.P2_22 58.42,13.2 59.67,11.95 59.67,9.64 58.42,8.39 CN3.P2_22
N$63
  Bottom 0.5: CN1.P2_20 60.96,13.2 62.21,11.95 62.21,9.64 60.96,8.39 CN3.P2_20
N$64
  Bottom 0.5: CN1.P2_18 63.5,13.2 64.75,11.95 64.75,10.4 64.75,9.64 63.5,8.39 CN3.P2_18
N$65
  Bottom 0.5: CN1.P2_16 66.04,13.2 67.29,11.95 67.29,9.64 66.04,8.39 CN3.P2_16
N$66
  Bottom 0.5: CN1.P2_14 68.58,13.2 69.83,11.95 69.83,9.64 68.58,8.39 CN3.P2_14
N$67
  Bottom 0.5: CN1.P2_12 71.12,13.2 72.37,11.95 72.37,9.64 71.12,8.39 CN3.P2_12
N$68
  Bottom 0.5: CN1.P2_10 73.66,13.2 74.91,11.95 74.91,9.64 73.66,8.39 CN3.P2_10
N$69
  Bottom 0.5: CN1.P2_8 76.2,13.2 77.45,11.95 77.45,9.64 76.2,8.39 CN3.P2_8
N$70
  Bottom 0.5: CN1.P2_6 78.74,13.2 79.99,11.95 79.99,9.64 78.74,8.39 CN3.P2_6
N$71
  Bottom 0.5: CN1.P2_4 81.28,13.2 82.53,11.95 82.53,9.64 81.28,8.39 CN3.P2_4
N$72
  Bottom 0.5: CN1.P2_2 83.82,13.67 85.07,12.42 85.07,9.17 83.82,7.92 CN3.P2_2
N$73
  Top 0.5: U1.2 32.38,49.69 X1.1
N$74
  Top 0.5: U1.1 33.66,49.49 X1.2
N$75
  Top 0.5: U1.3 31.11,49.69 30.8,50 30.8,57 CR2032.+
PWM0A  (via drill 0.4 pad 0.8)
  Top 0.5: CN1.P1_36 39.37,46.99 39.37,49.53 40.64,50.8 40.64,58.36 CN2.P1_36 | R6.1 31.35,38.15 v31.8,38.4
  Bottom 0.5: v31.8,38.4 31.2,39.2 31.2,43.8 33.12,45.72 CN1.P1_36
SPI0.CLK  (via drill 0.4 pad 0.8)
  Top 0.5: CN1.P1_8 74.93,46.99 74.93,49.53 76.2,50.8 76.2,58.36 CN2.P1_8 | v19.2,22.6 19.2,5 20.6,3.6 30.6,3.6 31.8,4.8 31.75,4.85 SPI0.CLK
  Bottom 0.5: U2.6 16.36,22.6 v19.2,22.6 | SPI0.CLK 31.75,5.75 32.6,6.6 37.09,6.6 37.9,7.4 37.9,23.94 39.76,25.8 76.2,25.8 78,27.6 78,43.92 CN1.P1_8
SPI0.CS  (via drill 0.4 pad 0.8)
  Top 0.5: CN1.P1_6 77.47,46.99 77.47,49.53 78.8,50.86 CN2.P1_6 | SPI0.CS 34.29,4.89 31.4,2 18,2 15.4,4.6 15.4,17.2 v15.2,17.4
  Bottom 0.5: U2.1 9.69,19.96 | 9.69,19.96 R8.1 | 9.69,19.96 9.69,18.71 10.4,18.2 14.6,18.2 v15.2,17.4 | SPI0.CS 36.72,5.08 38.55,6.91 38.55,23.67 39.88,25 76.6,25 78.74,27.14 CN1.P1_6
SPI0.HOLD#
  Top 0.5: CN1.P1_4 80.01,46.99 80.01,49.53 81.28,50.8 81.28,58.36 CN2.P1_4
  Bottom 0.5: U2.7 17.79,21.23 R7.1 19.55,21.25 20,20.8 20,4.5 22.15,2.15 22.23,2.07 35.07,2.07 39.2,6.2 39.2,23.4 40,24.2 77,24.2 81.28,28.48 CN1.P1_4
SPI0.MISO  (via drill 0.4 pad 0.8)
  Top 0.5: CN1.P1_10 72.39,46.99 72.39,49.53 73.66,50.8 73.66,58.36 CN2.P1_10 | v31.2,3 31,2.8 19.4,2.8 16.2,6 v16.2,19
  Bottom 0.5: CN1.P1_10 73.66,44.74 77.2,41.2 77.2,28.4 75.4,26.6 39.63,26.6 37.24,24.21 37.24,8.04 36.6,7.4 31.53,7.4 SPI0.MISO 29.21,3.81 29.2,3.8 30,3 v31.2,3 | U2.2 12.37,21.23 13.4,20.2 13.4,19.4 13.8,19 v16.2,19
SPI0.MOSI
  Top 0.5: CN1.P1_12 69.85,46.99 69.85,49.53 71.12,50.8 71.12,58.42 CN2.P1_12
  Bottom 0.5: CN1.P1_12 75.35,41.09 76.2,40.24 76.2,29.2 74.4,27.4 39.51,27.4 36.59,24.48 36.59,9.19 35.6,8.2 29.79,8.2 SPI0.MOSI 26.67,3.87 25.8,3 24,3 22.93,4.07 22.93,22.22 22.8,22.69 21.8,23.8 21.43,23.77 U2.5
SPI0.WP#
  Top 0.5: CN1.P2_1 83.82,22.09 85.07,20.84 85.07,18.53 83.82,17.28 CN3.P2_1
  Bottom 0.5: R9.1 9.74,22.5 U2.3 13.11,22.5 13.4,22.8 13.4,24.6 13,25 7.8,25 6.6,23.8 6.6,18.4 8.2,17.4 14,17.4 19.2,11.8 19.2,3.4 21.4,1.2 77.4,1.2 82.6,6.4 82.6,8.79 83.19,9.37 83.19,9.53 CN3.P2_1
SPI1.CLK
  Top 0.5: CN3.P2_29 48.26,17.28 49.51,18.53 49.51,20.84 48.26,22.09 CN1.P2_29 48.26,24.94 46,27.2 41.2,27.2 38.4,24.4 38.4,16.81 38.4,13.2 37.2,12 33.6,12 SPI1.CLK
SPI1.CS
  Top 0.5: CN3.P2_31 45.72,17.28 46.97,18.53 46.97,20.84 45.72,22.09 CN1.P2_31 45.72,25.08 44.4,26.4 41.6,26.4 39.2,24 39.2,15.07 39.2,11.6 37.76,10.16 SPI1.CS
SPI1.MISO
  Top 0.5: CN3.P2_27 50.8,17.28 52.05,18.53 52.05,20.84 50.8,22.09 CN1.P2_27 50.8,26.8 49.6,28 40.8,28 37.6,24.8 37.6,14.4 36.4,13.2 32.4,13.2 30.8,13.2 29.4,11.8 29.36,11.76 29.36,10.16 SPI1.MISO
SPI1.MOSI
  Top 0.5: CN3.P2_25 53.34,17.28 54.59,18.53 54.59,20.84 53.34,22.09 CN1.P2_25 53.34,27.06 51.6,28.8 40.4,28.8 36.8,25.2 36.8,15.2 36,14.4 30.91,14.4 30.8,14.4 29.6,13.2 27.8,13.2 26.8,12.2 26.67,12.07 SPI1.MOSI
UART0.RX  (via drill 0.4 pad 0.8)
  Top 0.5: CN1.P1_32 45.52,45.92 | 45.52,45.92 44.45,46.99 44.45,49.53 45.72,50.8 45.72,58.36 CN2.P1_32 | CN8.TXD2 85.92,36 v74,36 | v54.4,41.6 47.6,41.6 45.52,43.68 45.52,45.92
  Bottom 0.5: v74,36 73.6,35.6 58.4,35.6 54.4,39.6 v54.4,41.6
UART0.TX  (via drill 0.4 pad 0.8)
  Top 0.5: CN2.P1_30 48.32,50.86 46.99,49.53 46.99,46.99 CN1.P1_30 48.26,44.54 49.6,43.2 v54.4,43.2 | CN8.RXD2 74.1,38.1 v74,38
  Bottom 0.5: v74,38 72.4,36.4 60.8,36.4 56,41.2 56,42.4 55.2,43.2 v54.4,43.2
VIN  (via drill 0.4 pad 0.8)
  Top 1: v73.2,39.6 76.8,43.2 85.6,43.2 87,44.4 87,47.2 85.74,48.26 CN1.P1_1 | v68.4,37.6 43.6,37.6 34.8,28.8 27.8,28.8 24.75,25.75 D1.A 15.95,25.6 15.95,22.75 15,21.8 11.93,21.8 C2.+ | DC5V.2 12.55,18.39 | 12.55,18.39 12.62,21.18 12.54,21.86 C2.+ | 11.05,21.2 C2.+ | U$1.1 4.74,18.39 12.55,18.39
  Bottom 0.5: CN2.P1_1 83.82,60.96 83.82,60.13 82.63,58.94 82.63,56.63 83.82,55.44 CN1.P1_1
  Bottom 1: v68.4,37.6 71.2,37.6 v73.2,39.6

### Text on the board
tPlace: 3V3 | G | V | V | G | V | C | G | V | C | PocketBeagle Hotdog v1.0 | D | D
bPlace: AN-PB01 | 20180204.YK
tDocu: PROJECT : PocketBeagle Hotdog | VERSION : v1.0 | Width : 0.5 mm | Grid : 0.2 mm | Via : 1.6 mm | Drill : 0.8 mm | Font : 1.2 mm | DATE : 2018/02/04
DrillLegend: LAYER-STACK
DrillLegend_01-16: 01-16
DrillLegend_01-20: 01-20
tPCB-ID: PocketBeagle Hotdog
bPCB-ID: PocketBeagle Hotdog
tTOP-LAYERDESC: TOP
bBOTTOM-LAYERDESC: BOTTOM
tSILK-LAYERDESC: TOP-SILK
bSILK-LAYERDESC: BOTTOM-SILK
tSTOP-LAYERDESC: TOP-SOLDERMASK
bSTOP-LAYERDESC: BOTTOM-SOLDERMASK
tMETALMASK-LAYERDESC: TOP-METALMASK
bMERALMASK-LAYERDESC: BOTTOM-METALMASK
DRILL-LIST-LAYERDESC: DRILL